# Altium project Driver Morpheus V7.0.PrjPcb
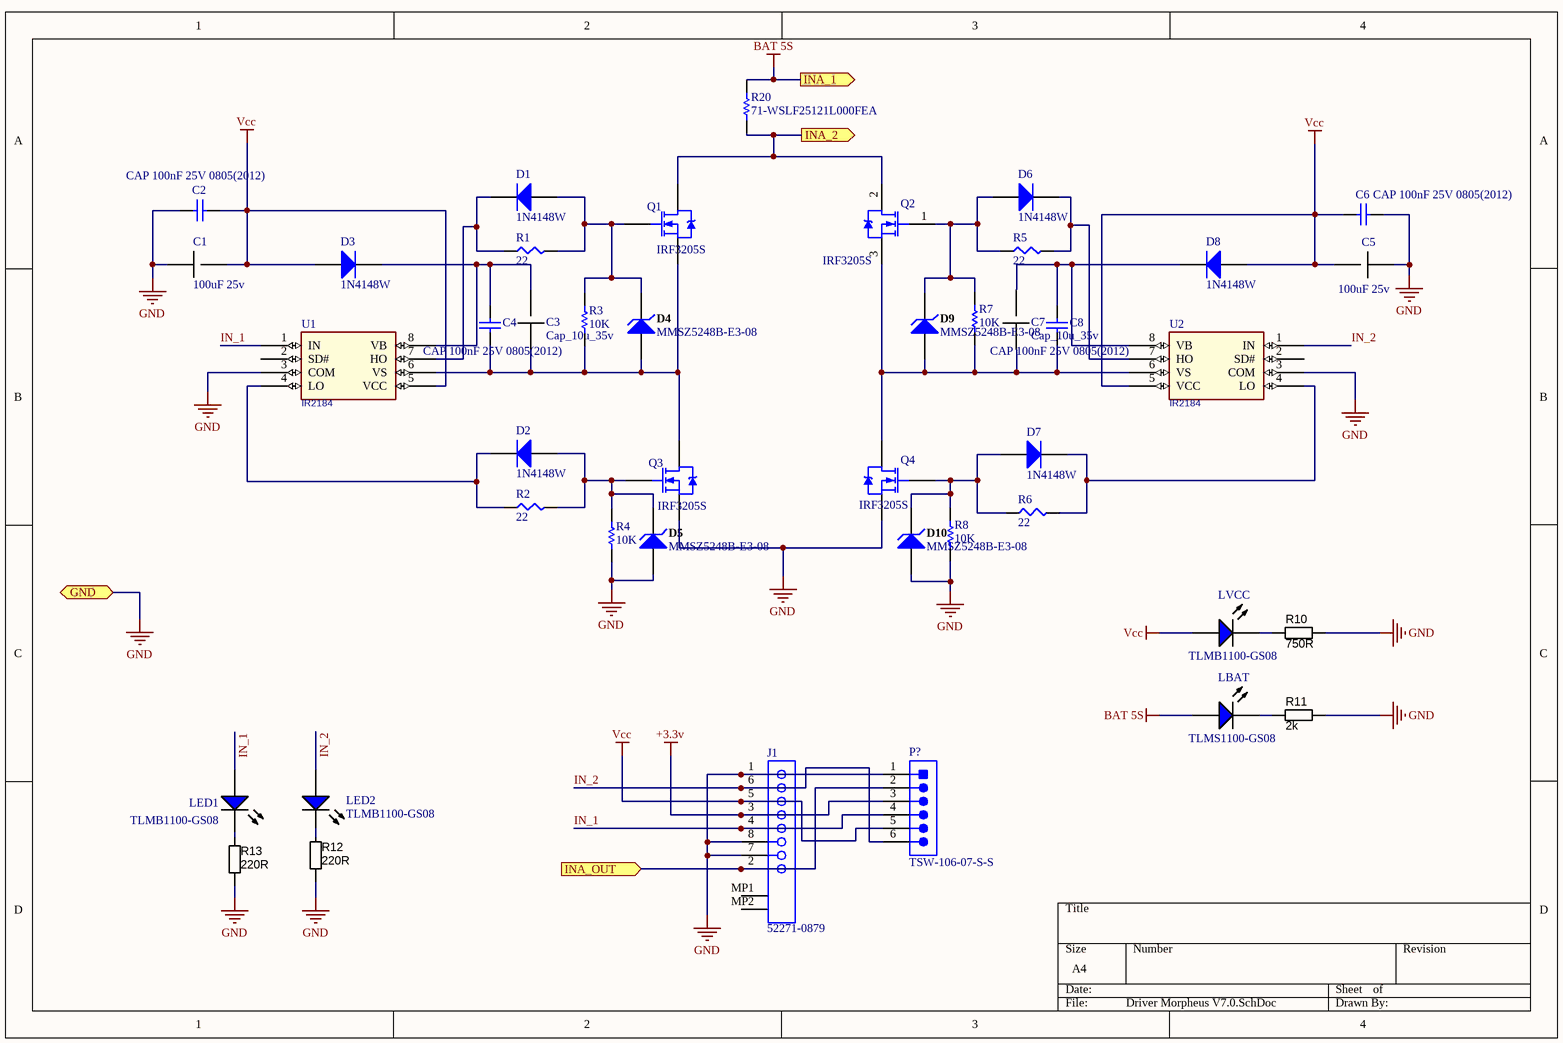
[diagram p0: Driver Morpheus V7.0.SchDoc]
2 sheets, 50 parts. Net scope: flat (ports and power ports of the same name join across sheets).
Board file: Driver Morpheus v7.0.PcbDoc
Sheets:
  Driver Morpheus V7.0.SchDoc
  INA169.SchDoc

## Sheet Driver Morpheus V7.0.SchDoc
size A4

### Parts
C1  100uF 25v  [CAP_ELEC_SIZE_E]
C2  CAP 100nF 25V 0805(2012)  [CAPC0805(2012)145_M]
C3  Cap_10u_35v  [CAP POL 2917/7343]
C4  CAP 100nF 25V 0805(2012)  [CAPC0805(2012)145_M]
C5  100uF 25v  [CAP_ELEC_SIZE_E]
C6  CAP 100nF 25V 0805(2012)  [CAPC0805(2012)145_M]
C7  Cap_10u_35v  [CAP POL 2917/7343]
C8  CAP 100nF 25V 0805(2012)  [CAPC0805(2012)145_M]
D1  1N4148W  [JSCJ-SOD-123-2_V]
D2  1N4148W  [JSCJ-SOD-123-2_V]
D3  1N4148W  [JSCJ-SOD-123-2_V]
D4  MMSZ5248B-E3-08  [VISH-SOD-123-2_V]
D5  MMSZ5248B-E3-08  [VISH-SOD-123-2_V]
D6  1N4148W  [JSCJ-SOD-123-2_V]
D7  1N4148W  [JSCJ-SOD-123-2_V]
D8  1N4148W  [JSCJ-SOD-123-2_V]
D9  MMSZ5248B-E3-08  [VISH-SOD-123-2_V]
D10  MMSZ5248B-E3-08  [VISH-SOD-123-2_V]
J1  52271-0879  [MOLX-52271-0879]
LBAT  TLMS1100-GS08  [VISH-TLMX1100-2_V]
LED1  TLMB1100-GS08  [VISH-TLMX1100-2_V]
LED2  TLMB1100-GS08  [VISH-TLMX1100-2_V]
LVCC  TLMB1100-GS08  [VISH-TLMX1100-2_V]
P?  TSW-106-07-S-S  [SMTC-TSW-106-07-S-S_V]
Q1  IRF3205S  [D2PAK-3]
Q2  IRF3205S  [D2PAK-3]
Q3  IRF3205S  [D2PAK-3]
Q4  IRF3205S  [D2PAK-3]
R1  22  [0603ESDA]
R2  22  [0603ESDA]
R3  value 10K  [SMD-0603-RES]  (hidden comment: RC0402JR-071KL)
R4  value 10K  [SMD-0603-RES]  (hidden comment: RC0402JR-071KL)
R5  22  [0603ESDA]
R6  22  [0603ESDA]
R7  value 10K  [SMD-0603-RES]  (hidden comment: RC0402JR-071KL)
R8  value 10K  [SMD-0603-RES]  (hidden comment: RC0402JR-071KL)
R10  value 750R  [RESC1608X55N]  (hidden comment: Thick Film)
R11  value 2k  [RESC1608X55N]  (hidden comment: Thick Film)
R12  value 220R  [RESC1608X55N]  (hidden comment: Thick Film)
R13  value 220R  [RESC1608X55N]  (hidden comment: Thick Film)
R20  71-WSLF25121L000FEA  [RESC6432X89X76ML25T25]
U1  IR2184  [SOIC127P600X175-8AN]
U2  IR2184  [SOIC127P600X175-8AN]

### Ports
GND (bidir), INA_1 (out), INA_2 (out), INA_OUT (in)

### Nets
+3.3v: J1.3 P?.3
BAT 5S: LBAT.1(A) R20.2 ; port INA_1
GND: C1.2 C2.1 C5.2 C6.1 D5.1(A) D10.1(A) J1.1 J1.7 J1.8 P?.1 Q3.3(S) Q4.3(S) R4.1 R8.1 R10.2 R11.2 R12.2 R13.2 U1.3(COM) U2.3(COM) ; port GND
Vcc: C1.1 C2.2 C5.1 C6.2 D3.1(+) D8.1(+) J1.5 LVCC.1(A) P?.5 U1.5(VCC) U2.5(VCC)
IN_1: J1.4 LED1.1(A) P?.4 U1.1(IN)
IN_2: J1.6 LED2.1(A) P?.6 U2.1(IN)
NetC3_1: C3.1 C4.2 D3.2(-) U1.8(VB)
NetC3_2: C3.2 C4.1 D4.1(A) Q1.3(S) Q3.2(D) R3.1 U1.6(VS)
NetC7_1: C7.1 C8.2 D8.2(-) U2.8(VB)
NetC7_2: C7.2 C8.1 D9.1(A) Q2.3(S) Q4.2(D) R7.1 U2.6(VS)
NetC11_1: J1.2 P?.2 ; port INA_OUT
NetD1_1: D1.1(+) D4.2(K) Q1.1(G) R1.2 R3.2
NetD1_2: D1.2(-) R1.1 U1.7(HO)
NetD2_1: D2.1(+) D5.2(K) Q3.1(G) R2.2 R4.2
NetD2_2: D2.2(-) R2.1 U1.4(LO)
NetD6_1: D6.1(+) D9.2(K) Q2.1(G) R5.1 R7.2
NetD6_2: D6.2(-) R5.2 U2.7(HO)
NetD7_1: D7.1(+) D10.2(K) Q4.1(G) R6.1 R8.2
NetD7_2: D7.2(-) R6.2 U2.4(LO)
NetLBAT_2: LBAT.2(K) R11.1
NetLED1_2: LED1.2(K) R13.1
NetLED2_2: LED2.2(K) R12.1
NetLVCC_2: LVCC.2(K) R10.1
NetQ1_2: Q1.2(D) Q2.2(D) R20.1 ; port INA_2

Not connected (* = marked no-connect by the designer): J1 MP1 MP2; U1 2(SD#); U2 2(SD#)

### Library data of the parts
C1 = Cap_10u_35v
C2 C4 C6 C8 = CMP-1036-04408-1: CAP 100nF 25V ±5% 0805 (2012 Metric) Thickness 1.45mm SMD; Case-Metric: 2012; Case-EIA: 0805; Tolerance: Â±5%; Value: 100nF; Rated Voltage: 25 V; Max Thickness: 1.45 mm; Technology: SMT
C5 = Cap_100u_25v: Cap Tântalo
D1-D3 D6-D8 = CMP-0914-00001-1: Fast Switching Diode, 75 V, 150 mA, 2-Pin 2.7 x 1.6 x 1.25 mm SMD, Tape and Reel; Manufacturer: Changjiang Electronics; TSTG (degC): -55 to 150; IR (uA): 1; VR (V): 75; VF (V): 1.25; PD (mW): 350; Trr (ns): 4; IO (mA): 150; Packing: Tape and Reel; ComponentLink2URL: http://www.cj-elec.com/txUpfile/20121613352740313.pdf; PackageReference: SOD-123-2; PackageVersion: Rev. A; DatasheetVersion: Rev. A; ComponentLink3Description: Package Specification; ComponentLink3URL: http://www.cj-elec.com/txUpfile/201412112231195145.pdf; ComponentLink1Description: Manufacturer URL; ComponentLink1URL: http://www.cj-elec.com/; PartNumber: 1N4148W; ComponentLink2Description: Datasheet; PackageDescription: 2-Pin SMD, Body 2.7 x 1.6 mm, Height 1.25 mm; Mounting Technology: Surface Mount
D4 D5 D9 D10 = CMP-0931-00036-1: Small Signal Zener Diode, 18 V +/- 5%, -55 to 155 degC, 2-Pin SOD-123, RoHS, Tape and Reel; Manufacturer: Vishay Semiconductor; Tolerance: +/- 5%; Power Dissipation (mW): 500; Zener Voltage (NOM.) (V): 18; Int. Construction: Single; Zener Impedance (IZT1) (Max.) (Ohm): 21; Test Current (IZT1) (mA): 7; Mounting Technology: Surface Mount; RoHS: TRUE; ComponentLink2URL: http://www.vishay.com/docs/85774/mmsz5225.pdf; ComponentLink1URL: http://www.vishay.com/; PackageVersion: Rev. 1.9; PartNumber: MMSZ5248B-E3-08; PackageReference: SOD-123-2; ComponentLink1Description: Manufacturer URL; Packing: Tape and Reel; ComponentLink3URL: http://www.vishay.com/docs/85774/mmsz5225.pdf; PackageDescription: 2-Pin SMD, Body 2.7 x 1.55 mm, Height 1.35 mm; Operating Temperature: -55 to 150 degC; DatasheetVersion: Rev. 1.9; ComponentLink2Description: Datasheet; ComponentLink3Description: Package Specification
J1 = CMP-1241-00231-1: 1.0 mm Pitch Easy-On(TM) Type FPC Connector, 3.0 mm Mated Height, Right Angle, ZIF, SMT, Bottom Contact, 8 Circuits, -40 to 85 degC, ELV and RoHS Compliant, Tape and Reel; Manufacturer: Molex; Mated Height: 3.00mm; PCB Retention: Yes; Voltage (Max): 50V AC (RMS)/DC; Material - Metal: Phosphor Bronze; PCB Locator: No; Circuits (Loaded): 8; Material - Plating Termination: Tin-Bismuth; Entry Angle: 90degrees Angle; Pitch - Mating Interface: 1.00mm; Current (Max per Contact): 0.5A; Durability (mating cycles max): 30; PackageReference: 52271-0879; PackageDescription: 8-Lead FPC Connector, Pitch 1.0 mm; Mounting Technology: Surface Mount; ComponentLink1URL: http://www.molex.com/molex/index.jsp; Number of Rows: 1; PackageVersion: Rev. B, 04/2004; ComponentLink1Description: Manufacturer URL; Contact Position: Bottom; RoHS: TRUE; ComponentLink3URL: http://www.molex.com/pdm_docs/sd/522710879_sd.pdf; PartNumber: 52271-0879; Orientation: Right Angle; Stackable: No; ComponentLink2URL: http://www.molex.com/webdocs/datasheets/pdf/en-us/0522710879_FFC_FPC_CONNECTORS.pdf; ComponentLink3Description: Package Specification; ComponentLink2Description: Datasheet; Polarized to PCB: Yes; Packing: Tape and Reel; Material - Plating Mating: Tin-Bismuth; Pitch - Termination Interface: 1.00mm
LBAT = CMP-1666-00028-1: Red LED, 10 mA, 2.0 V, -40 to 100 degC, 2-Pin SMD (0603), RoHS, Tape and Reel / (https://br.mouser.com/datasheet/2/427/tlmb1100-279843.pdf); Tolerance: 10%; Voltage Rating: 100 V; Capacitance: 10 nF; Type (Capacitors): X7R; Case\Package: Radial; ComponentLink1Description: Manufacturer URL; REACH SVHC: No SVHC; Package Quantity: 500; PackageDescription: 2-Pin Surface Mount Device, Body 1.6 x 0.8 mm; Pins: 2; ComponentLink2URL: http://download.siliconexpert.com/pdfs/2016/8/7/12/43/26/667/vsh_/manual/379263299541529tlmb1100.pdf; RoHSCompliant: true; Lead Pitch: 2.54 mm; Height: 2.54 mm; DatasheetVersion: Rev. 2.7, 03/2016; Length: 5.33 mm; ComponentLink1URL: http://www.vishay.com/; Min Operating Temperature: -55 degC; PackageReference: 0603; Packaging: Bulk; ComponentLink2Description: Datasheet; Max Operating Temperature: 125 degC; Radiation Hardening: No; Width: 3.81 mm; Mount: Through Hole
LED1 LED2 = CMP-1666-00028-1: Blue LED, 10 mA, 3.9 V, -40 to 100 degC, 2-Pin SMD (0603), RoHS, Tape and Reel; Tolerance: 10%; Voltage Rating: 100 V; Capacitance: 10 nF; Type (Capacitors): X7R; Case\Package: Radial; ComponentLink1Description: Manufacturer URL; REACH SVHC: No SVHC; Package Quantity: 500; PackageDescription: 2-Pin Surface Mount Device, Body 1.6 x 0.8 mm; Pins: 2; ComponentLink2URL: http://download.siliconexpert.com/pdfs/2016/8/7/12/43/26/667/vsh_/manual/379263299541529tlmb1100.pdf; RoHSCompliant: true; Lead Pitch: 2.54 mm; Height: 2.54 mm; DatasheetVersion: Rev. 2.7, 03/2016; Length: 5.33 mm; ComponentLink1URL: http://www.vishay.com/; Min Operating Temperature: -55 degC; PackageReference: 0603; Packaging: Bulk; ComponentLink2Description: Datasheet; Max Operating Temperature: 125 degC; Radiation Hardening: No; Width: 3.81 mm; Mount: Through Hole
LVCC = CMP-1666-00028-1: Blue LED, 15 mA, 3.9 V, -40 to 100 degC, 2-Pin SMD (0603), RoHS, Tape and Reel / (https://br.mouser.com/datasheet/2/427/tlmb1100-279843.pdf); Tolerance: 10%; Voltage Rating: 100 V; Capacitance: 10 nF; Type (Capacitors): X7R; Case\Package: Radial; ComponentLink1Description: Manufacturer URL; REACH SVHC: No SVHC; Package Quantity: 500; PackageDescription: 2-Pin Surface Mount Device, Body 1.6 x 0.8 mm; Pins: 2; ComponentLink2URL: http://download.siliconexpert.com/pdfs/2016/8/7/12/43/26/667/vsh_/manual/379263299541529tlmb1100.pdf; RoHSCompliant: true; Lead Pitch: 2.54 mm; Height: 2.54 mm; DatasheetVersion: Rev. 2.7, 03/2016; Length: 5.33 mm; ComponentLink1URL: http://www.vishay.com/; Min Operating Temperature: -55 degC; PackageReference: 0603; Packaging: Bulk; ComponentLink2Description: Datasheet; Max Operating Temperature: 125 degC; Radiation Hardening: No; Width: 3.81 mm; Mount: Through Hole
P? = CMP-1681-00007-1: Male Header, Pitch 2.54 mm, 1 x 6 Position, Height 8.38 mm, Tail Length 2.54 mm, -55 to 125 degC, RoHS, Bulk; Rows: 1; Mounting Technology: Through Hole; Mount: Through Hole; Pins: 6; Contact Material: Bronze; Contact Finish: Gold; Lead Pitch: 0.1 inch; Length: 15.24 mm; PackageDescription: Male Header, Pitch 2.54 mm, 1 x 6 Position, Height 8.38 mm, Tail Length 2.54 mm; PackageReference: TSW-102-07-S-S; Package Quantity: 1; DatasheetVersion: 12/2015; Colour: Black; Max Operating Temperature: 125 degC; RoHSCompliant: true; Height: 8.38 mm; Packaging: Bulk; Contact Plating: Gold; Min Operating Temperature: -55 degC
Q1-Q4 = IRF3205S: HEXFET Power MOSFET; Published: 8-Jun-2000; LatestRevisionDate: 20-Nov-2009; LatestRevisionNote: IPC-7351 Footprint Added.; DatasheetVersion: Aug-1997; PackageReference: D2PAK; Publisher: Altium Limited; PackageDescription: 3-Pin Transistor Outline Package 2.54 mm Pitch, 15.1 mm Lead Span; ComponentLink1Description: Manufacturer Link; ComponentLink1URL: http://www.irf.com/; ComponentLink2Description: Datasheet; ComponentLink2URL: http://www.irf.com/product-info/datasheets/data/irf3205s.pdf
R1 R2 R5 R6 = ERJ-3EKF22R0V: RES SMD 22 OHM 1% 1/10W 0603; Manufacturer: Panasonic Electronic Components; Factory Stock: 0; Unit Price (USD): 0.00379; @ qty: 1500; Minimum Quantity: 1; Power (Watts): 0.1W, 1/10W; Temperature Coefficient: ±100ppm/°C; Part Number: ERJ-3EKF22R0V; Datasheets: http://industrial.panasonic.com/www-cgi/jvcr13pz.cgi?E+PZ+3+AOA0002+ERJ3EKF22R0V+7+WW; Image: //media.digikey.com/Photos/Panasonic%20Photos/MFG_ERJ-P6W%20Series.jpg; Digi-Key Part Number: P22.0HCT-ND; Quantity Available: 100321; Packaging: Cut Tape (CT); Series: ERJ; Part Status: Active; Value: 22; Tolerance: ±1%; Composition: Thick Film; Features: Automotive AEC-Q200; Operating Temperature: -55°C ~ 155°C; Package / Case: 0603 (1608 Metric); Supplier Device Package: 0603; Size / Dimension: 0.063" L x 0.031" W (1.60mm x 0.80mm); Height - Seated (Max): 0.022" (0.55mm); Number of Terminations: 2; Failure Rate: -
R3 R4 R7 R8 = RES 1K 0402: RES SMD 10K OHM 5% 1/16W 0402
R10 = RES_220R_0603_5%: Resistor SMD chip 750 Ohm 1/16W 5% 0603; Manufacturer 1: Yageo; Manufacturer Part Number 1: RC0603JR-07220RL; Ratings: 1/10 W; SCDType: spec; Manufacturer 5: Royal Ohm; Manufacturer Part Number 5: 0603WAJ0221; Package / Case: 0603 (1608 metric); Tolerance: ±5%; Material: Thick Film; Supplier 1: Digi-Key; Supplier Part Number 1: 311-220GRCT-ND; Supplier 2: Digi-Key; Supplier Part Number 2: P220GCT-ND; Manufacturer 2: Panasonic Electronic Components; Manufacturer Part Number 2: ERJ-3GEYJ221V; RoHS 2: RoHS Compliant; ComponentLink2URL: http://industrial.panasonic.com/www-cgi/jvcr13pz.cgi?E+PZ+3+AOA0001+ERJ3GEYJ221V+7+WW; ComponentLink2Description: http://industrial.panasonic.com/www-cgi/jvcr13pz.cgi?E+PZ+3+AOA0001+ERJ3GEYJ221V+7+WW; ComponentLink1URL: http://www.yageo.com/documents/recent/PYu-RC0603_51_RoHS_L_4.pdf; ComponentLink1Description: http://www.yageo.com/documents/recent/PYu-RC0603_51_RoHS_L_4.pdf; Supplier 3: Digi-Key; Supplier Part Number 3: RMCF0603JT220RCT-ND; Manufacturer 3: Stackpole Electronics Inc; Manufacturer Part Number 3: RMCF0603JT220R; RoHS 3: RoHS Compliant; ComponentLink3URL: http://www.seielect.com/Catalog/SEI-RMCF_RMCP.pdf; ComponentLink3Description: http://www.seielect.com/Catalog/SEI-RMCF_RMCP.pdf; Supplier 4: Digi-Key; Supplier Part Number 4: RHM220CGCT-ND; Manufacturer 4: Rohm Semiconductor; Manufacturer Part Number 4: MCR03ERTJ221; RoHS 4: RoHS Compliant; ComponentLink4URL: http://rohmfs.rohm.com/en/products/databook/datasheet/passive/resistor/chip_resistor/mcr_g.pdf; ComponentLink4Description: http://rohmfs.rohm.com/en/products/databook/datasheet/passive/resistor/chip_resistor/mcr_g.pdf; RoHS 1: RoHS Compliant
R11 = RES_220R_0603_5%: Resistor SMD chip 2k Ohm 1/16W 5% 0603; Manufacturer 1: Yageo; Manufacturer Part Number 1: RC0603JR-07220RL; Ratings: 1/10 W; SCDType: spec; Manufacturer 5: Royal Ohm; Manufacturer Part Number 5: 0603WAJ0221; Package / Case: 0603 (1608 metric); Tolerance: ±5%; Material: Thick Film; Supplier 1: Digi-Key; Supplier Part Number 1: 311-220GRCT-ND; Supplier 2: Digi-Key; Supplier Part Number 2: P220GCT-ND; Manufacturer 2: Panasonic Electronic Components; Manufacturer Part Number 2: ERJ-3GEYJ221V; RoHS 2: RoHS Compliant; ComponentLink2URL: http://industrial.panasonic.com/www-cgi/jvcr13pz.cgi?E+PZ+3+AOA0001+ERJ3GEYJ221V+7+WW; ComponentLink2Description: http://industrial.panasonic.com/www-cgi/jvcr13pz.cgi?E+PZ+3+AOA0001+ERJ3GEYJ221V+7+WW; ComponentLink1URL: http://www.yageo.com/documents/recent/PYu-RC0603_51_RoHS_L_4.pdf; ComponentLink1Description: http://www.yageo.com/documents/recent/PYu-RC0603_51_RoHS_L_4.pdf; Supplier 3: Digi-Key; Supplier Part Number 3: RMCF0603JT220RCT-ND; Manufacturer 3: Stackpole Electronics Inc; Manufacturer Part Number 3: RMCF0603JT220R; RoHS 3: RoHS Compliant; ComponentLink3URL: http://www.seielect.com/Catalog/SEI-RMCF_RMCP.pdf; ComponentLink3Description: http://www.seielect.com/Catalog/SEI-RMCF_RMCP.pdf; Supplier 4: Digi-Key; Supplier Part Number 4: RHM220CGCT-ND; Manufacturer 4: Rohm Semiconductor; Manufacturer Part Number 4: MCR03ERTJ221; RoHS 4: RoHS Compliant; ComponentLink4URL: http://rohmfs.rohm.com/en/products/databook/datasheet/passive/resistor/chip_resistor/mcr_g.pdf; ComponentLink4Description: http://rohmfs.rohm.com/en/products/databook/datasheet/passive/resistor/chip_resistor/mcr_g.pdf; RoHS 1: RoHS Compliant
R12 R13 = RES_220R_0603_5%: Resistor SMD chip 220 Ohm 0.1W 5% 0603; Manufacturer 1: Yageo; Manufacturer Part Number 1: RC0603JR-07220RL; Ratings: 1/10 W; SCDType: spec; Manufacturer 5: Royal Ohm; Manufacturer Part Number 5: 0603WAJ0221; Package / Case: 0603 (1608 metric); Tolerance: ±5%; Material: Thick Film; Supplier 1: Digi-Key; Supplier Part Number 1: 311-220GRCT-ND; Supplier 2: Digi-Key; Supplier Part Number 2: P220GCT-ND; Manufacturer 2: Panasonic Electronic Components; Manufacturer Part Number 2: ERJ-3GEYJ221V; RoHS 2: RoHS Compliant; ComponentLink2URL: http://industrial.panasonic.com/www-cgi/jvcr13pz.cgi?E+PZ+3+AOA0001+ERJ3GEYJ221V+7+WW; ComponentLink2Description: http://industrial.panasonic.com/www-cgi/jvcr13pz.cgi?E+PZ+3+AOA0001+ERJ3GEYJ221V+7+WW; ComponentLink1URL: http://www.yageo.com/documents/recent/PYu-RC0603_51_RoHS_L_4.pdf; ComponentLink1Description: http://www.yageo.com/documents/recent/PYu-RC0603_51_RoHS_L_4.pdf; Supplier 3: Digi-Key; Supplier Part Number 3: RMCF0603JT220RCT-ND; Manufacturer 3: Stackpole Electronics Inc; Manufacturer Part Number 3: RMCF0603JT220R; RoHS 3: RoHS Compliant; ComponentLink3URL: http://www.seielect.com/Catalog/SEI-RMCF_RMCP.pdf; ComponentLink3Description: http://www.seielect.com/Catalog/SEI-RMCF_RMCP.pdf; Supplier 4: Digi-Key; Supplier Part Number 4: RHM220CGCT-ND; Manufacturer 4: Rohm Semiconductor; Manufacturer Part Number 4: MCR03ERTJ221; RoHS 4: RoHS Compliant; ComponentLink4URL: http://rohmfs.rohm.com/en/products/databook/datasheet/passive/resistor/chip_resistor/mcr_g.pdf; ComponentLink4Description: http://rohmfs.rohm.com/en/products/databook/datasheet/passive/resistor/chip_resistor/mcr_g.pdf; RoHS 1: RoHS Compliant
R20 = CMP-2000-07419-1: Chip Resistor, 1 mOhm, +/- 1%, 6 W, -65 to 170 degC, 2512 (6432 Metric), RoHS, Tape and Reel                        71-WSLF25121L000FEA; Manufacturer: Vishay; Case Height: 0.635mm; Resistance: 0.009Ohms; Case Width: 3.2mm; Case Length: 6.4mm; Brand: Vishay/Dale; Power Rating: 6W; Temperature Coefficient: 75PPM/C; Series: WSL; Package / Case: 2512(6432metric); Package Reference: 2512; Type: PowerMetalStripResistors,LowValue(downto0.0005Ohms),SurfaceMount; Termination Style: SMD/SMT; Case Code - mm: 6432; Case Code - in: 2512; Factory Pack Quantity: 2000; Operating Temperature Range: -65Cto+170C; Tolerance: 1%; Packaging: Reel; Datasheet URL: http://www.vishay.com/docs/30100/wsl.pdf; Package Description: 2-Pin Surface Mount Device, Body 6.35 x 3.18 mm; Manufacturer URL: http://www.vishay.com/; Datasheet Version: 07/2016; RoHS: Details; Product: MetalElementCurrentSensingResistors; Mounting Technology: SurfaceMount; Product Category: CurrentSenseResistors-SMD
U1 U2 = IR2184: PSpiceTemplate: X^@REFDES %VCC %IN %SD %COM %VB %HO %VS %LO @MODEL PARAMS:  ?CDELAY|CDELAY=@CDELAY||CDELAY=50N| ?RDELAY|RDELAY=@RDELAY||RDELAY=50| ?T1|T1=@T1||T1=-40| ?T2|T2=@T2||T2=25| ?T3|T3=@T3||T3=125| ?V1|V1=@V1||V1=10| ?V2|V2=@V2||V2=15| ?V3|V3=@V3||V3=20| ?TOFFT1|TOFFT1=@TOFFT1||TOFFT1=270N| ?TOFFT2|TOFFT2=@TOFFT2||TOFFT2=270N| ?TOFFT3|TOFFT3=@TOFFT3||TOFFT3=270N| ?TOFFV1|TOFFV1=@TOFFV1||TOFFV1=270N| ?TOFFV2|TOFFV2=@TOFFV2||TOFFV2=270N| ?TOFFV3|TOFFV3=@TOFFV3||TOFFV3=270N| ?TONT1|TONT1=@TONT1||TONT1=210N| ?TONT2|TONT2=@TONT2||TONT2=210N| ?TONT3|TONT3=@TONT3||TONT3=210N| ?TONV1|TONV1=@TONV1||TONV1=210N| ?TONV2|TONV2=@TONV2||TONV2=210N| ?TONV3|TONV3=@TONV3||TONV3=210N|; TONV3: 210N; TOFFV3: 270N; V3: 20; V2: 15; V1: 10; T3: 125; T2: 25; T1: -40; RDELAY: 50; CDELAY: 50N; TONV2: 210N; TONV1: 210N; TONT3: 210N; TONT2: 210N; TONT1: 210N; TOFFV2: 270N; TOFFV1: 270N; TOFFT3: 270N; TOFFT2: 270N; TOFFT1: 270N

## Sheet INA169.SchDoc
size A4
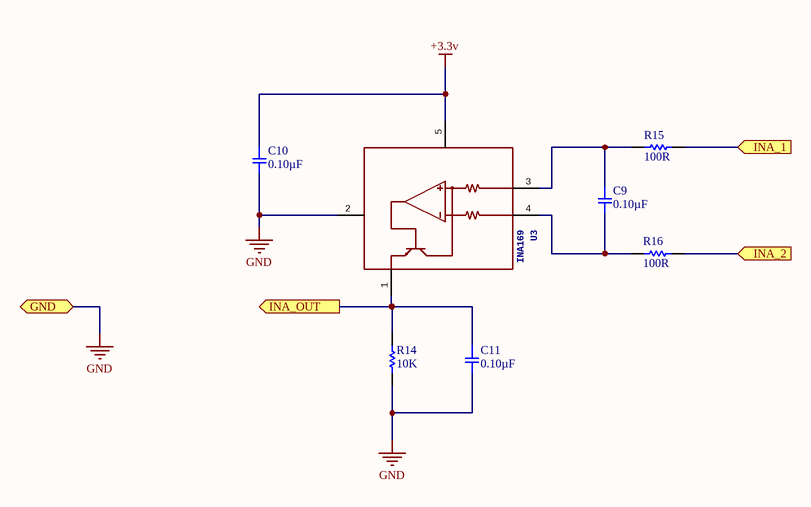
[diagram p1: INA169.SchDoc]

### Parts
C9  0.10µF  [SMD-0603C]
C10  0.10µF  [SMD-0603C]
C11  0.10µF  [SMD-0603C]
R14  value 10K  [SMD-0603-RES]  (hidden comment: RC0402JR-071KL)
R15  value 100R  [SMD-0603-RES]  (hidden comment: RC0402JR-071KL)
R16  value 100R  [SMD-0603-RES]  (hidden comment: RC0402JR-071KL)
U3  INA169  [SOT23-5]

### Ports
GND (bidir), INA_1 (in), INA_2 (in), INA_OUT (out)

### Nets
+3.3v: C10.1 U3.5(V+)
BAT 5S: R15.1 ; port INA_1
GND: C10.2 C11.2 R14.1 U3.2(GND) ; port GND
NetC9_1: C9.1 R15.2 U3.3(VIN+)
NetC9_2: C9.2 R16.2 U3.4(VIN-)
NetC11_1: C11.1 R14.2 U3.1(OUT) ; port INA_OUT
NetQ1_2: R16.1 ; port INA_2

### Library data of the parts
C9-C11 = GCJ188R71C104KA01D: CAP CER 0.1UF 16V X7R 0603; Manufacturer: Murata Electronics North America; Factory Stock: 0; Unit Price (USD): 0.21; Minimum Quantity: 1; Tolerance: ±10%; Datasheets: http://www.murata.com/~/media/webrenewal/support/library/catalog/products/capacitor/mlcc/c03e.ashx; Image: //media.digikey.com/Renders/Murata%20Renders/0603%28LQG18%29.jpg; Digi-Key Part Number: 490-5796-1-ND; Part Number: GCJ188R71C104KA01D; Quantity Available: 22473; @ qty: 0; Packaging: Cut Tape (CT); Series: GCJ; Part Status: Active; Value: 0.10µF; Voltage: 16V; Temperature Coefficient: X7R; Operating Temperature: -55°C ~ 125°C; Features: Soft Termination; Ratings: AEC-Q200; Applications: Automotive, Boardflex Sensitive; Mounting Type: Surface Mount, MLCC; Package / Case: 0603 (1608 Metric); Size / Dimension: 0.063" L x 0.031" W (1.60mm x 0.80mm); Height - Seated (Max): -; Thickness (Max): 0.035" (0.90mm); Lead Spacing: -; Lead Style: -
R14-R16 = RES 1K 0402: RES SMD 10K OHM 5% 1/16W 0402
U3 = INA169: GateName_1: G$1; MF: Texas Instruments; SymbolName_1: INA169; LibraryName: INA169; DeviceSetName: INA169; Package: SOT23-5; Price: None; Availability: Unavailable; MP: INA169; Package: None

## Nets that join several sheets
+3.3v: Driver Morpheus V7.0 (J1.3 P?.3), INA169 (C10.1 U3.5)
BAT 5S: Driver Morpheus V7.0 (LBAT.1 R20.2), INA169 (R15.1)
GND: Driver Morpheus V7.0 (20 pins), INA169 (C10.2 C11.2 R14.1 U3.2)
NetC11_1: Driver Morpheus V7.0 (J1.2 P?.2), INA169 (C11.1 R14.2 U3.1)
NetQ1_2: Driver Morpheus V7.0 (Q1.2 Q2.2 R20.1), INA169 (R16.1)